# EAGLE design LB_BIT_o11_servo-v03(rev4_4) (EAGLE 6.6.0)
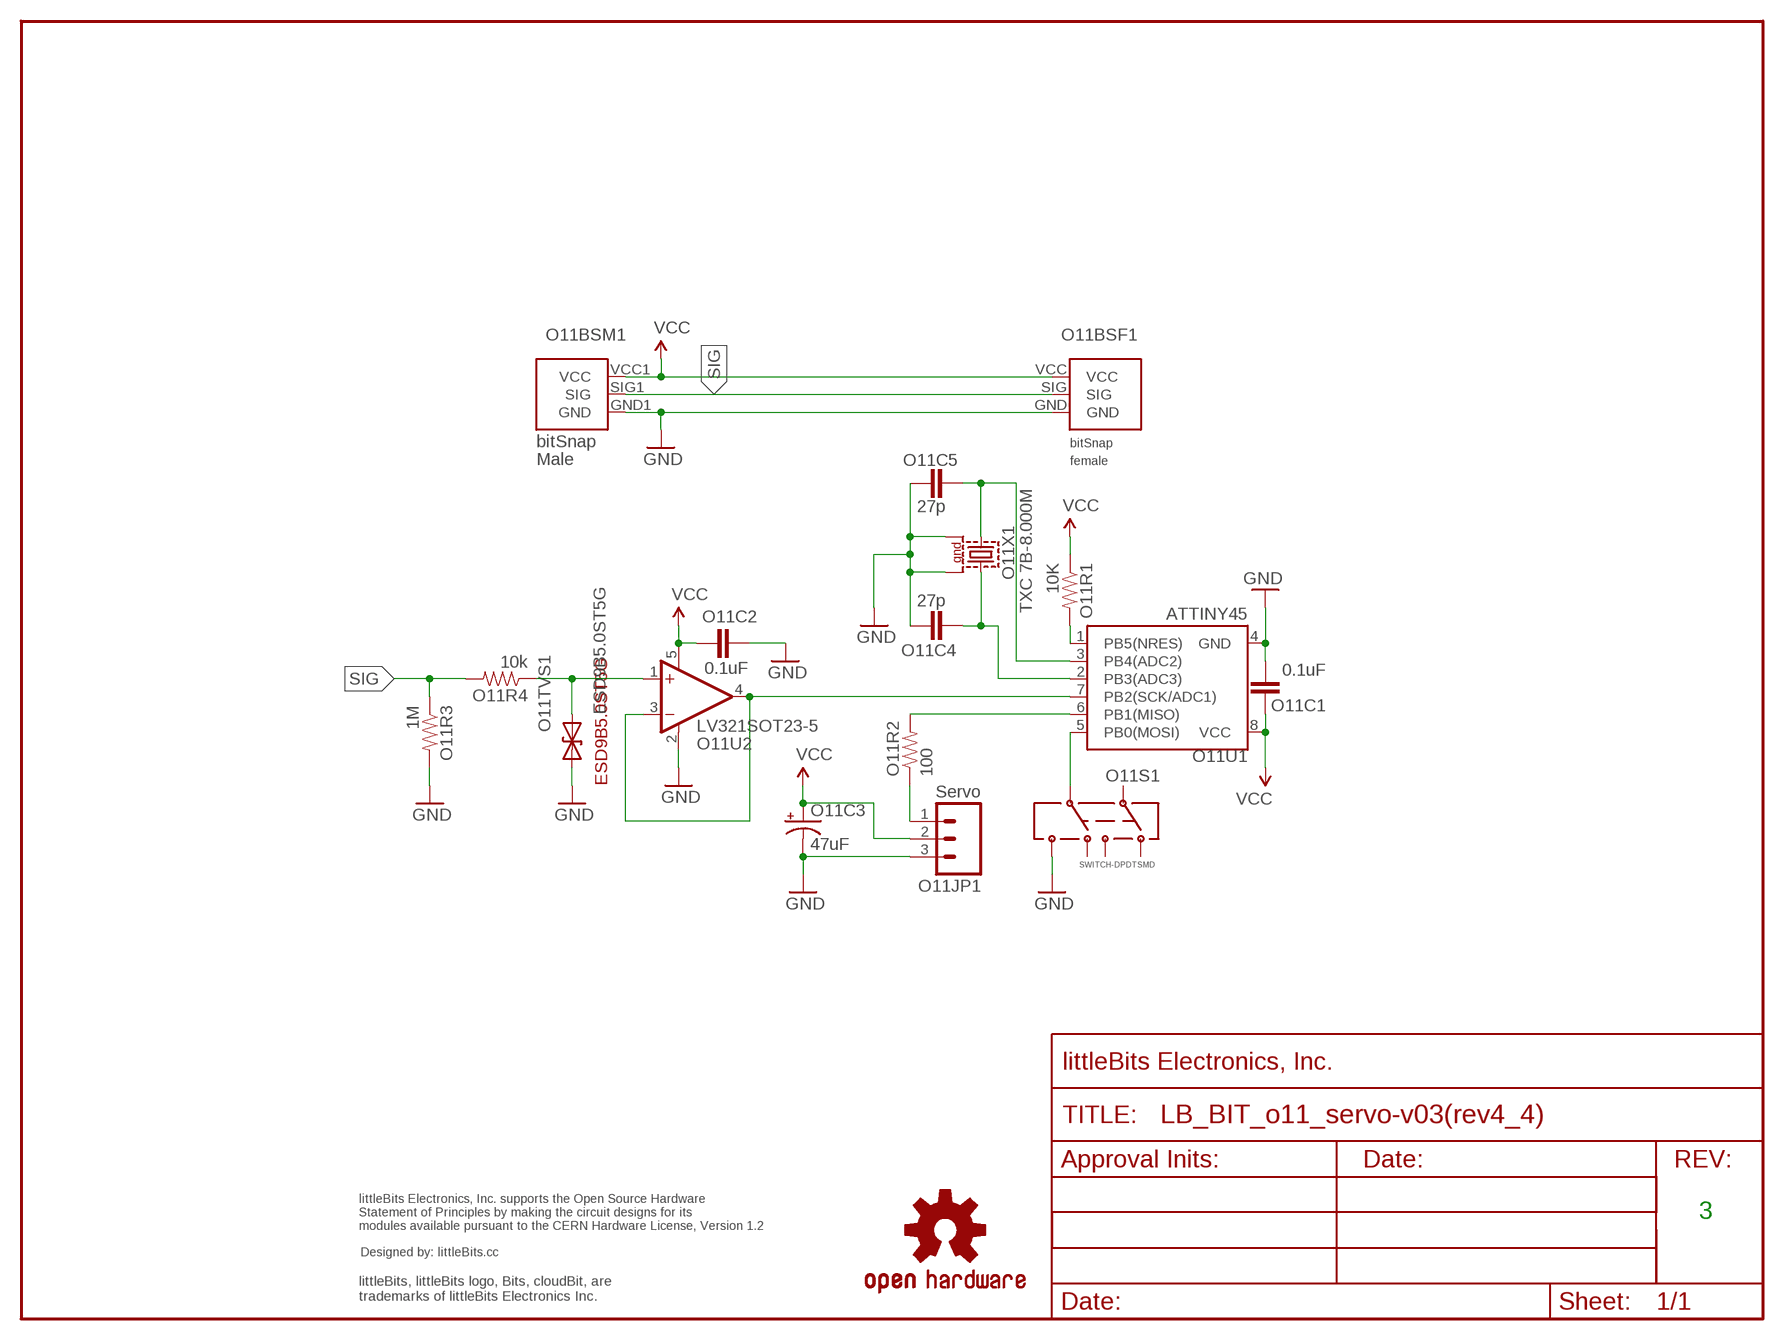
[diagram p0: schematic, sheet 1]

## Parts
O11BSF1  BITSNAP_V03_FEMALE  [BITSNAP_V03_FEMALE]
O11BSM1  BITSNAP_V03_MALE  [BITSNAP_V03_MALE]
O11C1  0.1uF  CAP0603-CAP  [0603-CAP]
O11C2  0.1uF  CAP0603-CAP  [0603-CAP]
O11C3  47uF  CAP_POL3216  [EIA3216]
O11C4  27p  CAP0603-CAP  [0603-CAP]
O11C5  27p  CAP0603-CAP  [0603-CAP]
O11JP1  Servo  M03PTH  [1X03]
O11R1  10K  RESISTOR0603-RES  [0603-RES]
O11R2  100  RESISTOR0603-RES  [0603-RES]
O11R3  1M  RESISTOR0603-RES  [0603-RES]
O11R4  10k  RESISTOR0603-RES  [0603-RES]
O11S1  SWITCH-DPDTSMD  [AYZ0202]
O11TVS1  ESD9B5.0ST5G  DIODE-TVSSOD-923  [SOD-923]
O11U1  ATTINY45  [SO08-EIAJ]
O11U2  LV321SOT23-5  [SOT23-5]
O11X1  TXC 7B-8.000M  CRYSTAL-SMD-7B-SERIES-TXC  [CRYSTAL-SMD-7B-SERIES-5X3.2MM]
U$1  FRAME-LETTER-OHWOHW  [FABDWG01-OHW]
U$13  OSHWCREDIT  [OSHWCREDIT]
U$25  OSHW-LOGOL  [OSHW-LOGO-L]

## Nets
GND: O11BSF1.GND O11BSM1.GND1(GND) O11C1.2 O11C2.2 O11C3.- O11C4.1 O11C5.2 O11JP1.3 O11R3.2 O11S1.6 O11TVS1.1(A) O11U1.4(GND) O11U2.2(V-) O11X1.P$2 O11X1.P$4
N$1: O11C5.1 O11U1.3(PB4(ADC2)) O11X1.P$1
N$2: O11C4.2 O11U1.2(PB3(ADC3)) O11X1.P$3
N$3: O11R1.2 O11U1.1(PB5(NRES))
N$4: O11S1.5 O11U1.5(PB0(MOSI))
N$5: O11JP1.1 O11R2.1
N$6: O11R2.2 O11U1.6(PB1(MISO))
N$7: O11U1.7(PB2(SCK/ADC1)) O11U2.3(-IN) O11U2.4(OUT)
N$8: O11R4.1 O11TVS1.2(C) O11U2.1(+IN)
SIG: O11BSF1.SIG O11BSM1.SIG1(SIG) O11R3.1 O11R4.2
VCC: O11BSF1.VCC O11BSM1.VCC1(VCC) O11C1.1 O11C2.1 O11C3.+ O11JP1.2 O11R1.1 O11U1.8(VCC) O11U2.5(V+)
Unconnected: O11S1.1 O11S1.2 O11S1.3 O11S1.4

## Notes on the sheet
- 3

## Library data of the parts
O11BSF1 = bitSnap:BITSNAP_V03_FEMALE
O11BSM1 = bitSnap:BITSNAP_V03_MALE
O11C1 O11C2 O11C4 O11C5 = SparkFun:CAP: Capacitor Standard 0603 ceramic capacitor, and 0.1" leaded capacitor.
O11C3 = LITTLEBITS:CAP_POL
O11JP1 = LITTLEBITS:M03: Header 3 Standard 3-pin 0.1" header. Use with straight break away headers (SKU : PRT-00116), right angle break away headers (PRT-00553), swiss pins (PRT-00743), machine pins (PRT-00117), and female headers (PRT-00115). Molex polarized connector foot print use with SKU : PRT-08232 with associated crimp pins and housings.
O11R1-O11R4 = SparkFun:RESISTOR: Resistor Basic schematic elements and footprints for 0603, 1206, and PTH 1/10th watt (small) resistors.
O11S1 = SparkFun:SWITCH-DPDT: DPDT Version of the COM-00597
O11TVS1 = LITTLEBITS:DIODE-TVS: Bidirectional Transient Voltage Suppression Diode: Device conducts in avalanche mode after reaching a part dependent voltage threshold. Used for limiting voltage spikes on ESD sensitive inputs and outputs.; IEC_ESD_PROT0: +/-18kV; LB_PN: ?; MPN: ESD9B5.0ST5G; V_CLAMP: ?; V_OPERATION: 5V
O11U1 = SparkFun:ATTINY45: Atmel ATTiny45
O11U2 = LITTLEBITS:LV321
O11X1 = LITTLEBITS:CRYSTAL-SMD-7B-SERIES-TXC; MFG: TXC; MPN: 7B SERIES
U$1 = LITTLEBITS:FRAME-LETTER-OHW
U$13 = LITTLEBITS:OSHWCREDIT
U$25 = LITTLEBITS:OSHW-LOGO: Open Source Hardware Logo This logo indicates the piece of hardware it is found on incorporates a OSHW license and/or adheres to the definition of open source hardware found here: http://freedomdefined.org/OSHW

## Board
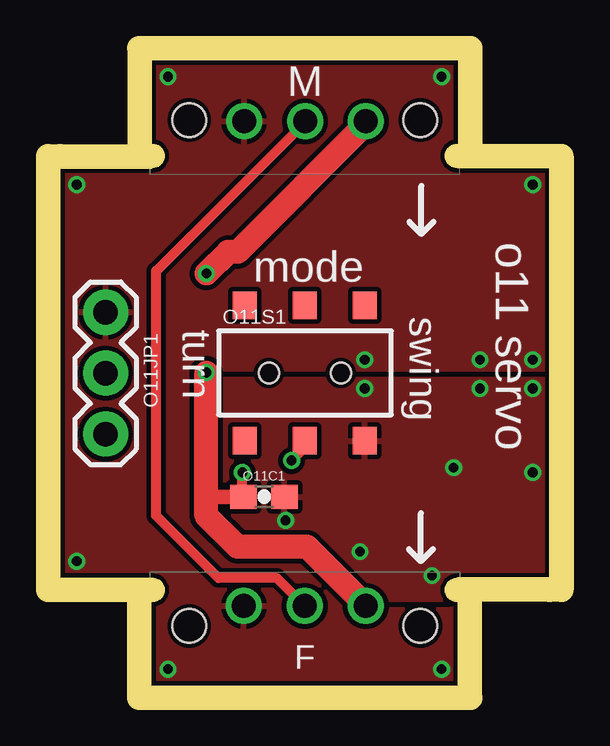
[diagram p1: board, top side]
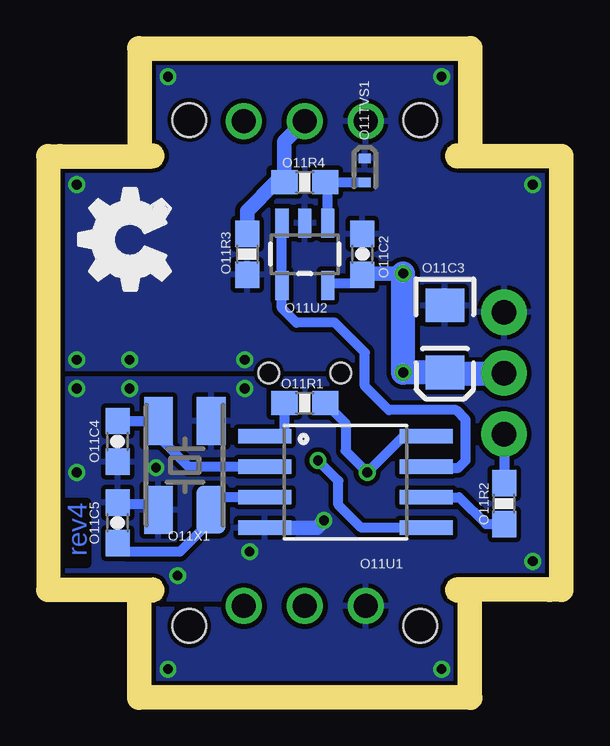
[diagram p2: board, bottom side, seen from below]

Size 20.4 x 26.1 mm. Coordinates in mm from the lower left corner, seen from the top.
Outline: 0,4.5 0,21.6
Outline: 20.4,4.5 20.4,21.6
Copper layers (1*16): Top 0.035mm / dielectric 1.5mm / Bottom 0.035mm
Design rules "default": minimum track width 0.2mm, minimum drill 0.4mm, track to track 0.2mm, track to pad 0.2mm, pad to pad 0.2mm, via to via 0.2mm, smd to smd 0mil, copper to edge 0.2mm, drill to drill 0.2mm, minimum pad ring 0.2mm, minimum via ring 0.15mm, stop-mask expansion 0.1mm, vias tented up to drill 0mil, thermal gap 0.2mm
tRestrict: 2 lines
bRestrict: 2 lines
Milling: 6 lines

### Footprints (pad centres in the part's own frame; a part is rotated, then mirrored left to right if it is on the bottom)
BITSNAP_V03_FEMALE = drill 1: GND 3.91,3.33; SIG 6.45,3.33; VCC 8.99,3.33 | hole 1.4: 1.63,2.5; 11.27,2.5
BITSNAP_V03_MALE = drill 1: GND1 8.98,2.56; SIG1 6.44,2.56; VCC1 3.9,2.56 | hole 1.4: 11.27,2.5; 1.63,2.5
0603-CAP = smd 1.1 x 1: 1 -0.85,0; 2 0.85,0
EIA3216 = smd 1.4 x 1.6: + 1.4,0; - -1.4,0
1X03 = drill 1.016 pad 1.88: 1 0,0; 2 2.54,0; 3 5.08,0
0603-RES = smd 1.1 x 1: 1 -0.85,0; 2 0.85,0
AYZ0202 = smd 1 x 1.15: 1 -2.5,2.825; 2 0,2.825; 3 2.5,2.825; 4 -2.5,-2.825; 5 0,-2.825; 6 2.5,-2.825 | hole 0.85: 1.5,0; -1.5,0
SOD-923 = smd 0.4 x 0.5: 1 -0.5,0; 2 0.5,0
SO08-EIAJ = smd 0.61 x 2.21: 1 -1.905,-3.378; 2 -0.635,-3.378; 3 0.635,-3.378; 4 1.905,-3.378; 5 1.905,3.353; 6 0.635,3.353; 7 -0.635,3.353; 8 -1.905,3.353
SOT23-5 = smd 0.55 x 1.2: 1 -0.95,-1.3; 2 0,-1.3; 3 0.95,-1.3; 4 0.95,1.3; 5 -0.95,1.3
CRYSTAL-SMD-7B-SERIES-5X3.2MM = smd 2 x 1.2: P$1 -1.85,-1.1; P$2 1.85,-1.1; P$3 1.85,1.1; P$4 -1.85,1.1

### Placement (x,y rotation side)
O11BSF1  3.75,0 0 top
O11BSM1  16.65,26.1 180 top
O11C1  8.5,7.89 0 top
O11C2  7.8,18 90 bottom
O11C3  4.36,14.47 270 bottom
O11C4  18,10.2 90 bottom
O11C5  18,6.8 90 bottom
O11JP1  1.9,10.5 90 top
O11R1  10.2,11.8 180 bottom
O11R2  1.9,7.6 270 bottom
O11R3  12.6,18 270 bottom
O11R4  10.2,21 180 bottom
O11S1  10.21,13.05 0 top
O11TVS1  7.7,21.5 270 bottom
O11U1  8.5,8.5 270 bottom
O11U2  10.2,18 180 bottom
O11X1  15.2,9.2 90 bottom
U$1  0,0 0 top
U$13  -91.15,-63.45 0 top  (outside the outline)
U$25  -29.3,-68.75 0 top  (outside the outline)
U$26  [OSHW_FILLX150_NOTEXT]  15.8,15.66 0 top

### Tracks (layer width: path | path; a pad name or v marks a point on that pad's centre or on a via)
GND  (via drill 0.41)
  Bottom 0.406: 18,7.7 17.9,7.6 16.4,7.6
  Bottom 0.61: O11U1.4 9.71,6.59 v9.4,6.9
  other vias: 12.5,5.6 19.7,12.4 12.7,12.4 15.5,4.6 17.5,12.4 19.7,13.6 17.5,13.6 12.7,13.6 19.7,20.9 15.9,25.4 4.5,25.4 0.7,20.9 0.7,5.2 4.5,0.7 15.9,0.7 19.7,8.9 16.4,9.1
  pour Top: 0,0 0,26.1 20.4,26.1 20.4,0
  pour Bottom: 0,0 0,26.1 20.4,26.1 20.4,0
N$1
  Bottom 0.406: O11U1.3 13.84,7.87 13.9,7.3 13.9,6.85 O11X1.P$1 14.1,6.7 14.3,6.7 15.4,5.6 17.6,5.6 17.95,5.95 O11C5.1
N$2
  Bottom 0.406: O11C4.2 16.35,11.05 16.3,11 O11X1.P$3 16.3,10.4 15.04,9.13 O11U1.2
N$3
  Bottom 0.406: O11R1.2 11.05,10.4 O11U1.1
N$4  (via drill 0.41)
  Top 0.406: v9.65,9.4 10.25,10
  Top 0.61: 10.25,10 10.2,10.25 O11S1.5
  Bottom 0.406: O11U1.5 7.84,6.59 8.8,7.55 8.8,8.55 v9.65,9.4
N$5
  Bottom 0.406: O11JP1.1 1.9,8.5 O11R2.1
N$6
  Bottom 0.406: O11U1.6 3.77,7.87 2.65,6.75 O11R2.2 2.19,6.45
N$7
  Bottom 0.406: O11U2.3 O11U2.4 11.15,15.75 10.55,15.15 8.95,15.15 7.7,13.9 7.7,12.5 6.7,11.5 3.9,11.5 3.5,11.1 3.5,9.4 3.8,9.1 5.11,9.1 O11U1.7
N$8
  Bottom 0.406: O11U2.1 9.25,20.9 O11R4.1 | O11R4.1 9.5,21 | O11R4.1 O11TVS1.2
SIG
  Top 0.406: O11BSF1.SIG 9.03,4.5 6.6,4.5 4,7.1 4,17.3 9.94,23.24 O11BSM1.SIG1
  Bottom 0.406: 11.4,21 O11R4.2
  Bottom 0.61: O11R3.1 12.6,19.8 11.4,21 | O11R4.2 11.05,22.7 O11BSM1.SIG1
VCC  (via drill 0.41)
  Top 0.406: O11C1.1 7.6,7.89 v7.6,8.9
  Top 0.61: O11C1.1 6.1,7.89
  Top 1: O11BSM1.VCC1 12.79,23.5 12.8,23.5 7.4,18.1 7,18.1 v6.1,17.2 | v6.1,13.07 6.1,7.89 6.1,7.1 7.4,5.8 10.3,5.8 12.7,3.4 12.7,3.33 O11BSF1.VCC
  Bottom 0.406: O11U2.5 9.25,16.8 8.15,16.8 arc-90 O11C2.1 | O11U1.8 6.1,10.4 v7.6,8.9 8.5,9.8 8.5,10.95 O11R1.1
  Bottom 0.61: O11JP1.2 1.94,13 | 4.3,13 O11C3.+ | v6.1,17.2 7.75,17.2
  Bottom 1: 1.94,13 4.3,13 | 7.75,17.2 O11C2.1 | O11C3.+ v6.1,13.07 v6.1,17.2

### Text on the board
Bottom: rev4
tPlace: o11 servo | mode | turn | swing
tValues: AYZ0202
Milling: 1mm DIA. ROUTER PATH
Reference: MEDIUM
dxf: 4 | Servo Motor Bit